# Altium schematic sheet CM_FMC-HPC-CDE.SchDoc
size Tabloid; SheetNumber: 13; SheetTotal: 14; Sheet_Name: CM_FMC-HPC-CDE; Size: 11x17
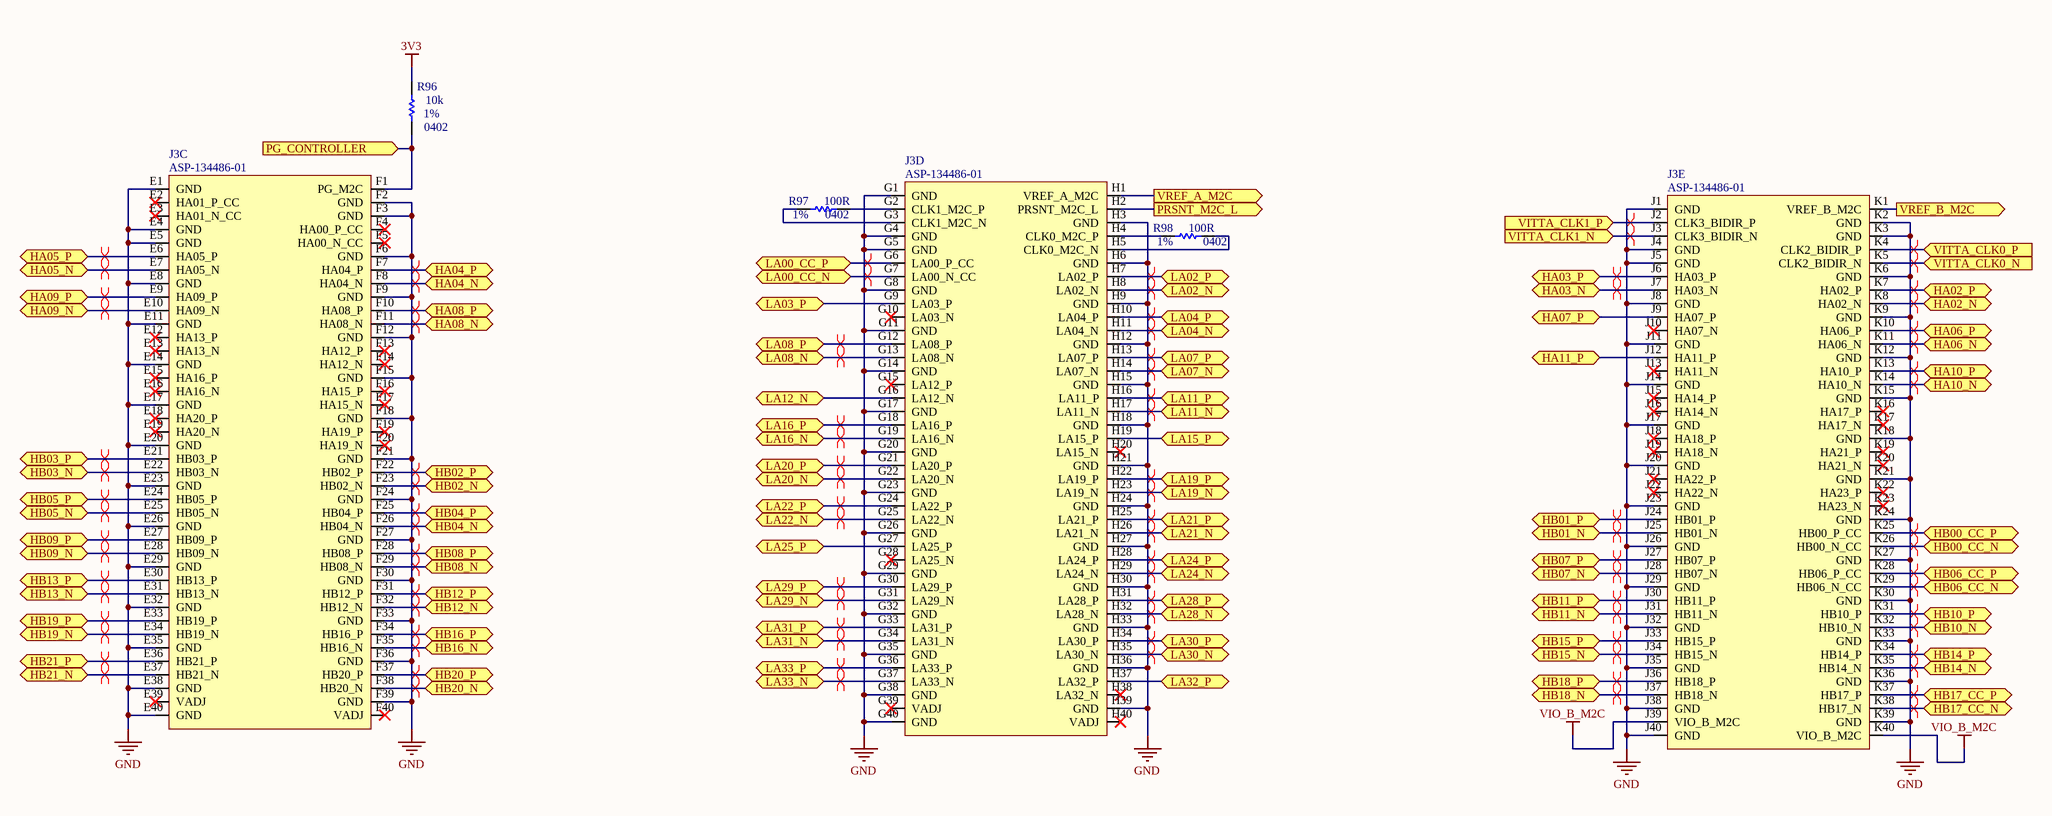
[diagram p0: CM_FMC-HPC-CDE.SchDoc]

## Parts
J3  ASP-134486-01  [CONN_SAMTEC_ASP-134486-01]  (parts C,D,E of 5)
R96  value 10k  Package: 0402  Precision: 1%  [RES_0402]  (hidden comment: RES - 0402)
R97  value 100R  Package: 0402  Precision: 1%  [RES_0402]  (hidden comment: RES - 0402)
R98  value 100R  Package: 0402  Precision: 1%  [RES_0402]  (hidden comment: RES - 0402)

## Ports
HA02_N (bidir), HA02_P (bidir), HA03_N (bidir), HA03_P (bidir), HA04_N (bidir), HA04_P (bidir), HA05_N (bidir), HA05_P (bidir), HA06_N (bidir), HA06_P (bidir), HA07_P (bidir), HA08_N (bidir), HA08_P (bidir), HA09_N (bidir), HA09_P (bidir), HA10_N (bidir), HA10_P (bidir), HA11_P (bidir), HB00_CC_N (bidir), HB00_CC_P (bidir), HB01_N (bidir), HB01_P (bidir), HB02_N (bidir), HB02_P (bidir), HB03_N (bidir), HB03_P (bidir), HB04_N (bidir), HB04_P (bidir), HB05_N (bidir), HB05_P (bidir), HB06_CC_N (bidir), HB06_CC_P (bidir), HB07_N (bidir), HB07_P (bidir), HB08_N (bidir), HB08_P (bidir), HB09_N (bidir), HB09_P (bidir), HB10_N (bidir), HB10_P (bidir), HB11_N (bidir), HB11_P (bidir), HB12_N (bidir), HB12_P (bidir), HB13_N (bidir), HB13_P (bidir), HB14_N (bidir), HB14_P (bidir), HB15_N (bidir), HB15_P (bidir), HB16_N (bidir), HB16_P (bidir), HB17_CC_N (bidir), HB17_CC_P (bidir), HB18_N (bidir), HB18_P (bidir), HB19_N (bidir), HB19_P (bidir), HB20_N (bidir), HB20_P (bidir), HB21_N (bidir), HB21_P (bidir), LA00_CC_N (bidir), LA00_CC_P (bidir), LA02_N (bidir), LA02_P (bidir), LA03_P (bidir), LA04_N (bidir), LA04_P (bidir), LA07_N (bidir), LA07_P (bidir), LA08_N (bidir), LA08_P (bidir), LA11_N (bidir), LA11_P (bidir), LA12_N (bidir), LA15_P (bidir), LA16_N (bidir), LA16_P (bidir), LA19_N (bidir), LA19_P (bidir), LA20_N (bidir), LA20_P (bidir), LA21_N (bidir), LA21_P (bidir), LA22_N (bidir), LA22_P (bidir), LA24_N (bidir), LA24_P (bidir), LA25_P (bidir), LA28_N (bidir), LA28_P (bidir), LA29_N (bidir), LA29_P (bidir), LA30_N (bidir), LA30_P (bidir), LA31_N (bidir), LA31_P (bidir), LA32_P (bidir), LA33_N (bidir), LA33_P (bidir), PG_CONTROLLER (in), PRSNT_M2C_L (out), VITTA_CLK0_N (in), VITTA_CLK0_P (in), VITTA_CLK1_N (in), VITTA_CLK1_P (in), VREF_A_M2C (out), VREF_B_M2C (out)

## Nets
3V3: R96.2
GND: J3.E1(GND) J3.E4(GND) J3.E5(GND) J3.E8(GND) J3.E11(GND) J3.E14(GND) J3.E17(GND) J3.E20(GND) J3.E23(GND) J3.E26(GND) J3.E29(GND) J3.E32(GND) J3.E35(GND) J3.E38(GND) J3.E40(GND) J3.F2(GND) J3.F3(GND) J3.F6(GND) J3.F9(GND) J3.F12(GND) J3.F15(GND) J3.F18(GND) J3.F21(GND) J3.F24(GND) J3.F27(GND) J3.F30(GND) J3.F33(GND) J3.F36(GND) J3.F39(GND) J3.G1(GND) J3.G4(GND) J3.G5(GND) J3.G8(GND) J3.G11(GND) J3.G14(GND) J3.G17(GND) J3.G20(GND) J3.G23(GND) J3.G26(GND) J3.G29(GND) J3.G32(GND) J3.G35(GND) J3.G38(GND) J3.G40(GND) J3.H3(GND) J3.H6(GND) J3.H9(GND) J3.H12(GND) J3.H15(GND) J3.H18(GND) J3.H21(GND) J3.H24(GND) J3.H27(GND) J3.H30(GND) J3.H33(GND) J3.H36(GND) J3.H39(GND) J3.J1(GND) J3.J4(GND) J3.J5(GND) J3.J8(GND) J3.J11(GND) J3.J14(GND) J3.J17(GND) J3.J20(GND) J3.J23(GND) J3.J26(GND) J3.J29(GND) J3.J32(GND) J3.J35(GND) J3.J38(GND) J3.J40(GND) J3.K2(GND) J3.K3(GND) J3.K6(GND) J3.K9(GND) J3.K12(GND) J3.K15(GND) J3.K18(GND) J3.K21(GND) J3.K24(GND) J3.K27(GND) J3.K30(GND) J3.K33(GND) J3.K36(GND) J3.K39(GND)
VIO_B_M2C: J3.J39(VIO_B_M2C) J3.K40(VIO_B_M2C)
HA02_N: J3.K8(HA02_N) ; port HA02_N
HA02_P: J3.K7(HA02_P) ; port HA02_P
HA03_N: J3.J7(HA03_N) ; port HA03_N
HA03_P: J3.J6(HA03_P) ; port HA03_P
HA04_N: J3.F8(HA04_N) ; port HA04_N
HA04_P: J3.F7(HA04_P) ; port HA04_P
HA05_N: J3.E7(HA05_N) ; port HA05_N
HA05_P: J3.E6(HA05_P) ; port HA05_P
HA06_N: J3.K11(HA06_N) ; port HA06_N
HA06_P: J3.K10(HA06_P) ; port HA06_P
HA07_P: J3.J9(HA07_P) ; port HA07_P
HA08_N: J3.F11(HA08_N) ; port HA08_N
HA08_P: J3.F10(HA08_P) ; port HA08_P
HA09_N: J3.E10(HA09_N) ; port HA09_N
HA09_P: J3.E9(HA09_P) ; port HA09_P
HA10_N: J3.K14(HA10_N) ; port HA10_N
HA10_P: J3.K13(HA10_P) ; port HA10_P
HA11_P: J3.J12(HA11_P) ; port HA11_P
HB00_CC_N: J3.K26(HB00_N_CC) ; port HB00_CC_N
HB00_CC_P: J3.K25(HB00_P_CC) ; port HB00_CC_P
HB01_N: J3.J25(HB01_N) ; port HB01_N
HB01_P: J3.J24(HB01_P) ; port HB01_P
HB02_N: J3.F23(HB02_N) ; port HB02_N
HB02_P: J3.F22(HB02_P) ; port HB02_P
HB03_N: J3.E22(HB03_N) ; port HB03_N
HB03_P: J3.E21(HB03_P) ; port HB03_P
HB04_N: J3.F26(HB04_N) ; port HB04_N
HB04_P: J3.F25(HB04_P) ; port HB04_P
HB05_N: J3.E25(HB05_N) ; port HB05_N
HB05_P: J3.E24(HB05_P) ; port HB05_P
HB06_CC_N: J3.K29(HB06_N_CC) ; port HB06_CC_N
HB06_CC_P: J3.K28(HB06_P_CC) ; port HB06_CC_P
HB07_N: J3.J28(HB07_N) ; port HB07_N
HB07_P: J3.J27(HB07_P) ; port HB07_P
HB08_N: J3.F29(HB08_N) ; port HB08_N
HB08_P: J3.F28(HB08_P) ; port HB08_P
HB09_N: J3.E28(HB09_N) ; port HB09_N
HB09_P: J3.E27(HB09_P) ; port HB09_P
HB10_N: J3.K32(HB10_N) ; port HB10_N
HB10_P: J3.K31(HB10_P) ; port HB10_P
HB11_N: J3.J31(HB11_N) ; port HB11_N
HB11_P: J3.J30(HB11_P) ; port HB11_P
HB12_N: J3.F32(HB12_N) ; port HB12_N
HB12_P: J3.F31(HB12_P) ; port HB12_P
HB13_N: J3.E31(HB13_N) ; port HB13_N
HB13_P: J3.E30(HB13_P) ; port HB13_P
HB14_N: J3.K35(HB14_N) ; port HB14_N
HB14_P: J3.K34(HB14_P) ; port HB14_P
HB15_N: J3.J34(HB15_N) ; port HB15_N
HB15_P: J3.J33(HB15_P) ; port HB15_P
HB16_N: J3.F35(HB16_N) ; port HB16_N
HB16_P: J3.F34(HB16_P) ; port HB16_P
HB17_CC_N: J3.K38(HB17_N) ; port HB17_CC_N
HB17_CC_P: J3.K37(HB17_P) ; port HB17_CC_P
HB18_N: J3.J37(HB18_N) ; port HB18_N
HB18_P: J3.J36(HB18_P) ; port HB18_P
HB19_N: J3.E34(HB19_N) ; port HB19_N
HB19_P: J3.E33(HB19_P) ; port HB19_P
HB20_N: J3.F38(HB20_N) ; port HB20_N
HB20_P: J3.F37(HB20_P) ; port HB20_P
HB21_N: J3.E37(HB21_N) ; port HB21_N
HB21_P: J3.E36(HB21_P) ; port HB21_P
LA00_CC_N: J3.G7(LA00_N_CC) ; port LA00_CC_N
LA00_CC_P: J3.G6(LA00_P_CC) ; port LA00_CC_P
LA02_N: J3.H8(LA02_N) ; port LA02_N
LA02_P: J3.H7(LA02_P) ; port LA02_P
LA03_P: J3.G9(LA03_P) ; port LA03_P
LA04_N: J3.H11(LA04_N) ; port LA04_N
LA04_P: J3.H10(LA04_P) ; port LA04_P
LA07_N: J3.H14(LA07_N) ; port LA07_N
LA07_P: J3.H13(LA07_P) ; port LA07_P
LA08_N: J3.G13(LA08_N) ; port LA08_N
LA08_P: J3.G12(LA08_P) ; port LA08_P
LA11_N: J3.H17(LA11_N) ; port LA11_N
LA11_P: J3.H16(LA11_P) ; port LA11_P
LA12_N: J3.G16(LA12_N) ; port LA12_N
LA15_P: J3.H19(LA15_P) ; port LA15_P
LA16_N: J3.G19(LA16_N) ; port LA16_N
LA16_P: J3.G18(LA16_P) ; port LA16_P
LA19_N: J3.H23(LA19_N) ; port LA19_N
LA19_P: J3.H22(LA19_P) ; port LA19_P
LA20_N: J3.G22(LA20_N) ; port LA20_N
LA20_P: J3.G21(LA20_P) ; port LA20_P
LA21_N: J3.H26(LA21_N) ; port LA21_N
LA21_P: J3.H25(LA21_P) ; port LA21_P
LA22_N: J3.G25(LA22_N) ; port LA22_N
LA22_P: J3.G24(LA22_P) ; port LA22_P
LA24_N: J3.H29(LA24_N) ; port LA24_N
LA24_P: J3.H28(LA24_P) ; port LA24_P
LA25_P: J3.G27(LA25_P) ; port LA25_P
LA28_N: J3.H32(LA28_N) ; port LA28_N
LA28_P: J3.H31(LA28_P) ; port LA28_P
LA29_N: J3.G31(LA29_N) ; port LA29_N
LA29_P: J3.G30(LA29_P) ; port LA29_P
LA30_N: J3.H35(LA30_N) ; port LA30_N
LA30_P: J3.H34(LA30_P) ; port LA30_P
LA31_N: J3.G34(LA31_N) ; port LA31_N
LA31_P: J3.G33(LA31_P) ; port LA31_P
LA32_P: J3.H37(LA32_P) ; port LA32_P
LA33_N: J3.G37(LA33_N) ; port LA33_N
LA33_P: J3.G36(LA33_P) ; port LA33_P
PG_CONTROLLER: J3.F1(PG_M2C) R96.1 ; port PG_CONTROLLER
PRSNT_M2C_L: J3.H2(PRSNT_M2C_L) ; port PRSNT_M2C_L
VITTA_CLK0_N: J3.K5(CLK2_BIDIR_N) ; port VITTA_CLK0_N
VITTA_CLK0_P: J3.K4(CLK2_BIDIR_P) ; port VITTA_CLK0_P
VITTA_CLK1_N: J3.J3(CLK3_BIDIR_N) ; port VITTA_CLK1_N
VITTA_CLK1_P: J3.J2(CLK3_BIDIR_P) ; port VITTA_CLK1_P
VREF_A_M2C: J3.H1(VREF_A_M2C) ; port VREF_A_M2C
VREF_B_M2C: J3.K1(VREF_B_M2C) ; port VREF_B_M2C
NetJ3_G2: J3.G2(CLK1_M2C_P) R97.1
NetJ3_G3: J3.G3(CLK1_M2C_N) R97.2
NetJ3_H4: J3.H4(CLK0_M2C_P) R98.2
NetJ3_H5: J3.H5(CLK0_M2C_N) R98.1

Not connected (* = marked no-connect by the designer): J3 E2(HA01_P_CC)* E3(HA01_N_CC)* E12(HA13_P)* E13(HA13_N)* E15(HA16_P)* E16(HA16_N)* E18(HA20_P)* E19(HA20_N)* E39(VADJ)* F4(HA00_P_CC)* F5(HA00_N_CC)* F13(HA12_P)* F14(HA12_N)* F16(HA15_P)* F17(HA15_N)* F19(HA19_P)* F20(HA19_N)* F40(VADJ)* G10(LA03_N)* G15(LA12_P)* G28(LA25_N)* G39(VADJ)* H20(LA15_N)* H38(LA32_N)* H40(VADJ)* J10(HA07_N)* J13(HA11_N)* J15(HA14_P)* J16(HA14_N)* J18(HA18_P)* J19(HA18_N)* J21(HA22_P)* J22(HA22_N)* K16(HA17_P)* K17(HA17_N)* K19(HA21_P)* K20(HA21_N)* K22(HA23_P)* K23(HA23_N)*

## Layout directives
differential pair: HA02_N, HA02_P, HA03_N, HA03_P, HA04_N, HA04_P, HA05_N, HA05_P, HA06_N, HA06_P, HA08_N, HA08_P, HA09_N, HA09_P, HA10_N, HA10_P, HB00_CC_N, HB00_CC_P, HB01_N, HB01_P, HB02_N, HB02_P, HB03_N, HB03_P, HB04_N, HB04_P, HB05_N, HB05_P, HB06_CC_N, HB06_CC_P, HB07_N, HB07_P, HB08_N, HB08_P, HB09_N, HB09_P, HB10_N, HB10_P, HB11_N, HB11_P, HB12_N, HB12_P, HB13_N, HB13_P, HB14_N, HB14_P, HB15_N, HB15_P, HB16_N, HB16_P, HB17_CC_N, HB17_CC_P, HB18_N, HB18_P, HB19_N, HB19_P, HB20_N, HB20_P, HB21_N, HB21_P, LA00_CC_N, LA00_CC_P, LA02_N, LA02_P, LA04_N, LA04_P, LA07_N, LA07_P, LA08_N, LA08_P, LA11_N, LA11_P, LA16_N, LA16_P, LA19_N, LA19_P, LA20_N, LA20_P, LA21_N, LA21_P, LA22_N, LA22_P, LA24_N, LA24_P, LA28_N, LA28_P, LA29_N, LA29_P, LA30_N, LA30_P, LA31_N, LA31_P, LA33_N, LA33_P, VITTA_CLK0_N, VITTA_CLK0_P, VITTA_CLK1_N, VITTA_CLK1_P

## Notes on the sheet
- Sheet Name
- Project Title
- Global Project
- Size
- Group
- Revision
- Date
- Sheet
- of
- Filename
- Designers

## Library data of the parts
J3 = CONN_SAMTEC_ASP-134486-01: CONN - VITA 57 MEZZ FEMALE (MOTHERBOARD) HIGH DENSITY - SMD-400; Voltage: 240VAC; Current: 1.8A; Mfg: Samtec; Power: *; Mfg Part Number: ASP-134486-01; HelpURL: http://suddendocs.samtec.com/prints/asp-134486-01-mkt.pdf; CreatedBy: Jonathan Bouchard; Temperature: -55 °C to +125 °C; Value: *; Precision: *; Package: SMD-400
R96-R98 = RES - 0402: Voltage: 50V; Power: 1/16W; Current: *; CreatedBy: Jonathan Bouchard